# Altium project RC522.PrjPcb
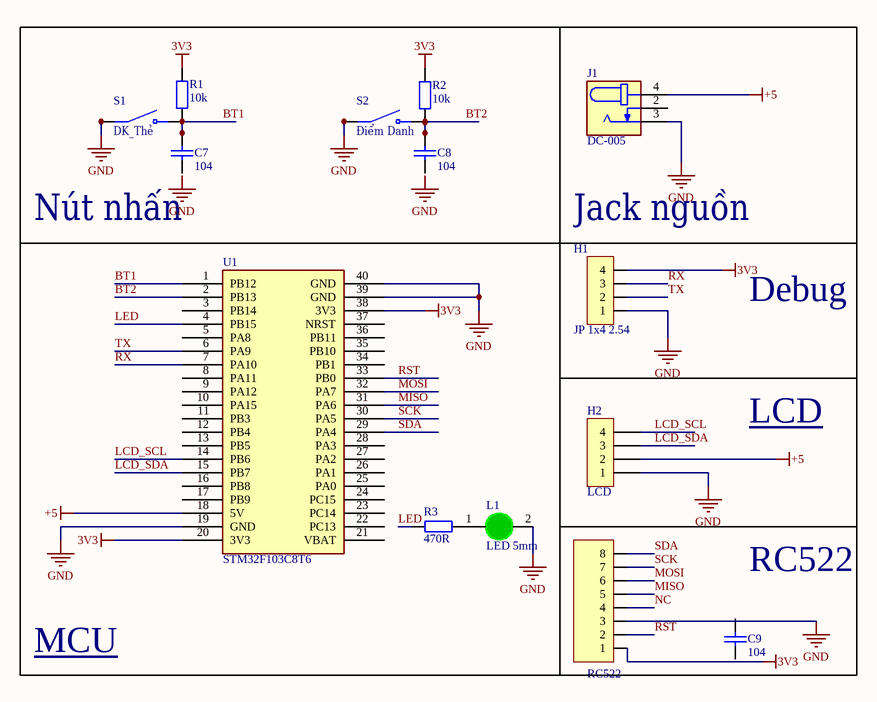
[diagram p0: RC522.SchDoc]
1 sheet, 14 parts. Net scope: global (net labels, ports and power ports of the same name join across sheets).
Board file: RC522.PcbDoc

## Sheet RC522.SchDoc
size A; SheetNumber: 1; SheetTotal: 1

### Parts
C7  104  [tu 1206]
C8  104  [tu 1206]
C9  104  [tu 1206]
H1  JP 1x4 2.54  [JP 1x4 DT]
H2  LCD  [XH2.54M-4]
H3  RC522  [JP 1x8 CT]
J1  DC-005  [NINIGI_DC-005]
L1  LED 5mm  [LED-5MM-Green]
R1  10k  [tro smd 1206]
R2  10k  [tro smd 1206]
R3  470R  [tro smd 1206]
S1  DK_Thẻ  [SW_B3F-4055]
S2  Điểm Danh  [SW_B3F-4055]
U1  STM32F103C8T6  [Stm32 BluePill]

### Nets
3V3: H1.4 H3.1 R1.2 U1.20(3V3) U1.38(3V3)
+5: H2.2 J1.4 U1.18(5V)
GND: H1.1 H2.1 H3.3 J1.3 L1.2(K) S1.1(COM) S1.2(COM) S2.1(COM) S2.2(COM) U1.19(GND) U1.39(GND) U1.40(GND)
BT1: C7.1 R1.1 S1.3(NO) S1.4(NO) U1.1(PB12)
BT2: C8.1 R2.1 S2.3(NO) S2.4(NO) U1.2(PB13)
LCD_SCL: H2.4 U1.14(PB6)
LCD_SDA: H2.3 U1.15(PB7)
LED: R3.2 U1.4(PB15)
MISO: H3.5 U1.31(PA6)
MOSI: H3.6 U1.32(PA7)
NC: H3.4
RST: H3.2 U1.33(PB0)
RX: H1.3 U1.7(PA10)
SCK: H3.7 U1.30(PA5)
SDA: H3.8 U1.29(PA4)
TX: H1.2 U1.6(PA9)
NetL1_1: L1.1(A) R3.1

Not connected (* = marked no-connect by the designer): C7 2; C8 2; C9 1 2; J1 2(4); R2 2; U1 3(PB14) 5(PA8) 8(PA11) 9(PA12) 10(PA15) 11(PB3) 12(PB4) 13(PB5) 16(PB8) 17(PB9) 21(VBAT) 22(PC13) 23(PC14) 24(PC15) 25(PA0) 26(PA1) 27(PA2) 28(PA3) 34(PB1) 35(PB10) 36(PB11) 37(NRST)

### Notes on the sheet
- (near C7) Nút nhấn
- (near H1) Jack nguồn
- Debug
- LCD
- (near C9) RC522
- MCU
- Labels drawn without touching a wire or pin: 3V3, GND

### Library data of the parts
C7-C9 = Tu 1206 104 50V 20%: Dán; So_Chan: 2; Ten_Linh_Kien: Tụ 1206 104-0.1uF 20% 50V; Don_Vi: Con; Ma_Hang: MH004544; Chung_Loai: Dán; Kieu_Chan: *
H1 = JP 1x4 2.54 Duc Thang: Cắm; Ten_Linh_Kien: Jump Đơn Đực 2.54MM 1x40P Thẳng 11MM; Don_Vi: Con; Ma_Hang: MH000903; Ghi_Chu: *; Kieu_Chan: *; Chung_Loai: Cắm
H2 = Header 4P 2.54 Duc Thang: Cắm; Ten_Linh_Kien: Header 4P XH2.54-4P Đực Thẳng; Don_Vi: Con; Ma_Hang: MH001285; Chung_Loai: Cắm
H3 = JP 1x8 2.54 Cai Thang: Cắm; Ten_Linh_Kien: Jump Đơn Cái 2.54MM 1x20P Thẳng; Don_Vi: Con; Ma_Hang: MH004006; Ghi_Chu: *; Kieu_Chan: *; Chung_Loai: Cắm
J1 = DC-005: DC Jack; Availability: Unavailable; MP: DC-005; Value: *; Package: None; Price: None
L1 = LED 5mm Xanh La: Cắm; Don_Vi: Con; Ma_Hang: MH008969; Ten_Linh_Kien: LED 5MM Phủ Xanh (1000c); Ghi_Chu: *; Kieu_Chan: *; Chung_Loai: Cắm
R1 R2 = Tro 1206 1% 10k: Dán; Don_Vi: Con; So_Chan: 2; Ten_Linh_Kien: Trở 1206 1% 10k; Ma_Hang: MH005885; Chung_Loai: Dán; Kieu_Chan: *
R3 = Tro 1206 1% 1k: Dán; Don_Vi: Con; So_Chan: 2; Ten_Linh_Kien: Trở 1206 1% 1k; Ma_Hang: MH005880; Chung_Loai: Dán; Kieu_Chan: *
S1 S2 = B3F-4055: Price: None; MP: B3F-4055; Availability: Unavailable; Value: *; Package: None
U1 = BluePill: Designed By @Alixahedi